# Altium schematic sheet Power.SchDoc
size A; SheetNumber: 6; SheetTotal: 6
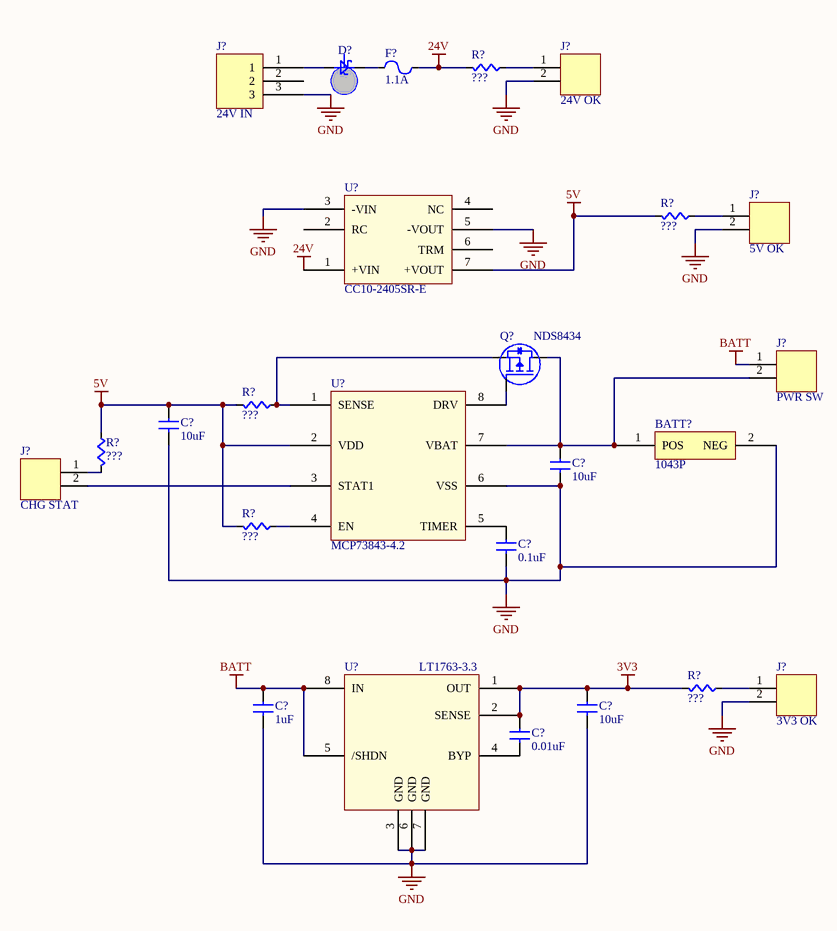
[diagram p0: Power.SchDoc]

## Parts
(Parts that share a designator on the sheet are numbered #1, #2 ... from top to bottom, then left to right.)
BATT?  1043P  [1043P]
C?#1  value 10uF  [CAPC0805]  (hidden comment: Cap)
C?#2  value 10uF  [CAPC0805]  (hidden comment: Cap)
C?#3  value 0.1uF  [CAPC0603]  (hidden comment: Cap)
C?#4  value 1uF  [CAPC0603]  (hidden comment: Cap)
C?#5  value 10uF  [CAPC0805]  (hidden comment: Cap)
C?#6  value 0.01uF  [CAPC0603]  (hidden comment: Cap)
D?  VS-15MQ040NTRPBF  [SS110-TP]  (value not drawn)
F?  value 1.1A  [PTC7451X11N]  (hidden comment: PTC Fuse)
J?#1  24V OK  [MOLEX-HDR-1X2-SHERLOCK-VERT]
J?#2  24V IN  [MCV_0,5/3-G-2,5]
J?#3  5V OK  [MOLEX-HDR-1X2-SHERLOCK-VERT]
J?#4  PWR SW  [MOLEX-HDR-1X2-SHERLOCK-VERT]
J?#5  CHG STAT  [MOLEX-HDR-1X2-SHERLOCK-VERT]
J?#6  3V3 OK  [MOLEX-HDR-1X2-SHERLOCK-VERT]
Q?  NDS8434  [NDS8434]
R?#1  value ???  [RES0603]  (hidden comment: Res)
R?#2  value ???  [RES0603]  (hidden comment: Res)
R?#3  value ???  [RES0603]  (hidden comment: Res)
R?#4  value ???  [RES0603]  (hidden comment: Res)
R?#5  value ???  [RES0603]  (hidden comment: Res)
R?#6  value ???  [RES0603]  (hidden comment: Res)
U?#1  CC10-2405SR-E  [CC10-2405SR-E]
U?#2  MCP73843-4.2  [MSOP-8N]
U?#3  LT1763-3.3  [8-SOIC]

## Nets
3V3: C?#5.1(A) C?#6.1(A) R?#6.1(A) U?#3.1(OUT) U?#3.2(SENSE)
5V: C?#1.1(A) R?#2.1(A) R?#3.1(A) R?#4.2(B) R?#5.1(A) U?#1.7(+VOUT) U?#2.2(VDD)
24V: F?.1(A) R?#1.1(A) U?#1.1(+VIN)
BATT: C?#4.1(A) J?#4.1 U?#3.5(/SHDN) U?#3.8(IN)
GND: BATT?.2(NEG) C?#1.2(B) C?#2.2(B) C?#3.2(B) C?#4.2(B) C?#5.2(B) J?#1.2 J?#2.3 J?#3.2 J?#6.2 U?#1.3(-VIN) U?#1.5(-VOUT) U?#2.6(VSS) U?#3.3(GND) U?#3.6(GND) U?#3.7(GND)
NetBATT?_1: BATT?.1(POS) C?#2.1(A) J?#4.2 Q?.D U?#2.7(VBAT)
NetC?#3_1: C?#3.1(A) U?#2.5(TIMER)
NetC?#6_2: C?#6.2(B) U?#3.4(BYP)
NetD?_A: D?.A J?#2.1
NetD?_C: D?.C F?.2(B)
NetJ?#1_1: J?#1.1 R?#1.2(B)
NetJ?#3_1: J?#3.1 R?#2.2(B)
NetJ?#5_1: J?#5.1 R?#4.1(A)
NetJ?#5_2: J?#5.2 U?#2.3(STAT1)
NetJ?#6_1: J?#6.1 R?#6.2(B)
NetQ?_G: Q?.G U?#2.8(DRV)
NetQ?_S: Q?.S R?#3.2(B) U?#2.1(SENSE)
NetR?#5_2: R?#5.2(B) U?#2.4(EN)

Not connected (* = marked no-connect by the designer): J?#2 2; U?#1 2(RC) 4(NC) 6(TRM)

## Library data of the parts
BATT? = 1043P: HOLDER FOR 18650 BATTERY; Manufacturer 1: Keystone Electronics; Supplier 1: Digi-Key; Supplier Part Number 1: 36-1043P-ND; Manufacturer Part Number 1: 1043P
D? = VS-15MQ040NTRPBF: DIODE SCHOTTKY 40V 1.5A SMA; Manufacturer 1: Vishay Semiconductor Diodes Division; Supplier 1: Digi-Key; Supplier Part Number 1: 15MQ040NPBFCT-ND; Manufacturer Part Number 1: VS-15MQ040NTRPBF
F? = PTC_Fuse: Supplier 1: Digi-Key; Supplier Part Number 1: 507-1744-1-ND
J?#1 J?#3-J?#6 = MOLEX-HDR-1x2-SHERLOCK_VERT: Header, Molex, 2mm Pitch Sherlock Header, Single Row, Vertical, 2 Circuits, Length 3.3mm, 0353620250; Manufacturer Part Number: *; Order Part Number: *
J?#2 = MCV_0,5/3-G-2,5: CONN TERM BLOCK 2.50MM 3POS, Vertical, Through-Hole, 4A; Manufacturer 1: Phoenix Contact; Manufacturer Part Number 1: 1881561; Mating Connector: 277-1431-ND; Supplier 1: Digi-Key; Supplier Part Number 1: 277-1453-ND
Q? = NDS8434: MOSFET P-CH 20V 6.5A 8-SOIC; Manufacturer 1: Fairchild Semiconductor; Manufacturer Part Number 1: NDS8434; Supplier 1: Digi-Key; Supplier Part Number 1: NDS8434CT-ND
U?#1 = CC10-2405SR-E: CONV DC/DC 10W SNGL 24V 5V SMD; Manufacturer: TDK-Lambda Americas Inc.; Manufacturer Part Number 1: CC10-2405SR-E; Supplier Part Number 1: 445-3307-ND; Supplier 1: Digi-Key
U?#2 = MCP73843-4.2: IC CONTROLLER LI-ION 4.2V 8MSOP; Manufacturer 1: Microchip Technology; Manufacturer Part Number 1: MCP73843-420I/MS; Supplier 1: Digi-Key; Supplier Part Number 1: MCP73843-420I/MS-ND
U?#3 = LT1763-3.3: IC REG LDO 3.3V 0.5A 8SOIC; Manufacturer 1: Linear Technology; Manufacturer Part Number 1: LT1763CS8-3.3#TRPBF; Supplier 1: Digi-Key; Supplier Part Number 1: LT1763CS8-3.3#TRPBFCT-ND
C?#1-C?#6 = Cap: Supplier 1: Digi-Key
  C?#1 C?#2 C?#5: Supplier Part Number 1: 490-3905-1-ND
  C?#3 C?#6: Supplier Part Number 1: 1276-1000-1-ND
  C?#4: Supplier Part Number 1: 490-3897-1-ND
R?#1-R?#6 = Res: Supplier 1: Digi-Key; Supplier Part Number 1: RMCF0603JT10K0CT-ND